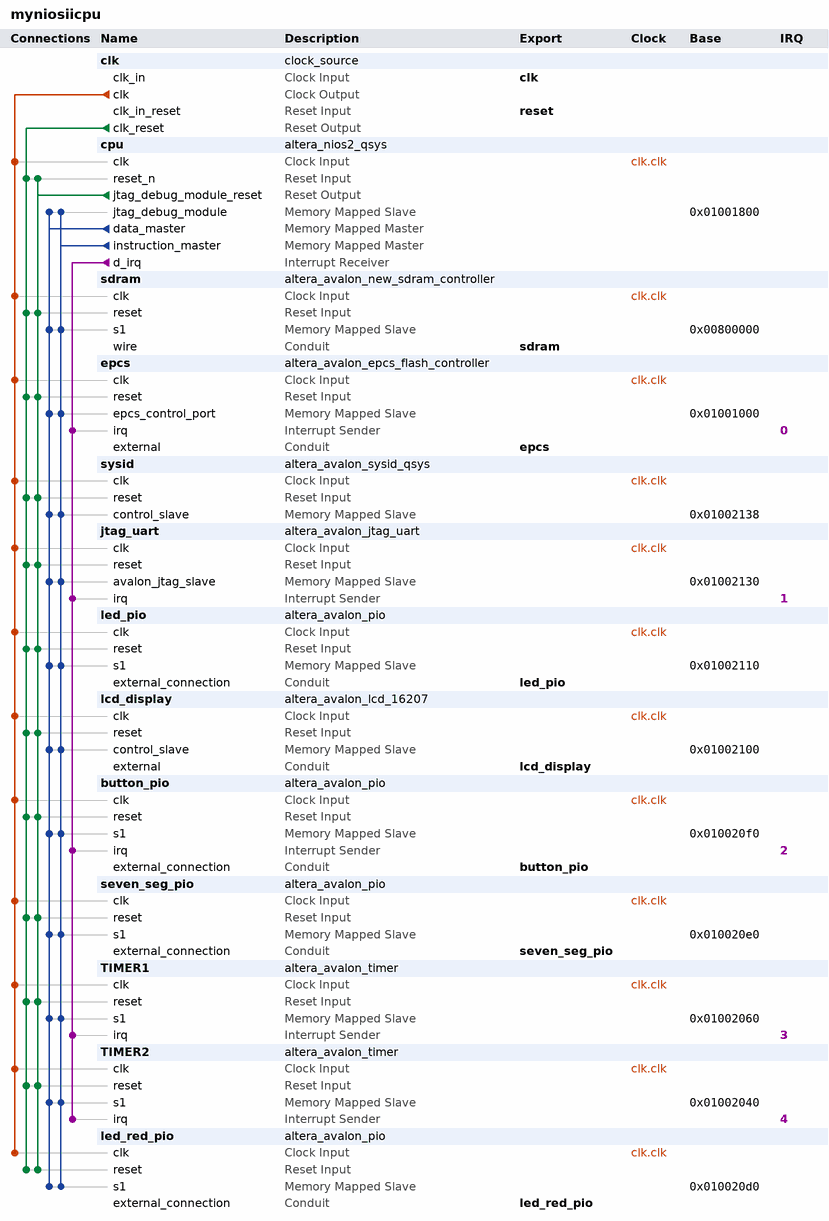
[diagram p0: system contents]
# Platform Designer (Qsys) system myniosiicpu, Cyclone IV E EP4CE115F29C7
# Parameters at their usual value, and those the tool derives, are not listed.
package require -exact qsys 13.0.1
create_system myniosiicpu
set_project_property DEVICE_FAMILY {Cyclone IV E}
set_project_property DEVICE EP4CE115F29C7

add_instance clk clock_source 13.0
set_instance_parameter_value clk clockFrequency 50000000

add_instance cpu altera_nios2_qsys 13.0
set_instance_parameter_value cpu resetSlave epcs.epcs_control_port
set_instance_parameter_value cpu mmu_TLBMissExcSlave None
set_instance_parameter_value cpu exceptionSlave sdram.s1
set_instance_parameter_value cpu breakSlave cpu.jtag_debug_module
set_instance_parameter_value cpu impl Fast
set_instance_parameter_value cpu icache_size 8192
set_instance_parameter_value cpu dcache_size 0

add_instance sdram altera_avalon_new_sdram_controller 13.0.1
set_instance_parameter_value sdram TAC 5.5
set_instance_parameter_value sdram TRCD 20.0
set_instance_parameter_value sdram TRP 20.0
set_instance_parameter_value sdram casLatency 3
set_instance_parameter_value sdram columnWidth 8
set_instance_parameter_value sdram dataWidth 16
set_instance_parameter_value sdram generateSimulationModel false
set_instance_parameter_value sdram model single_Micron_MT48LC4M32B2_7_chip
set_instance_parameter_value sdram numberOfBanks 4
set_instance_parameter_value sdram numberOfChipSelects 1
set_instance_parameter_value sdram powerUpDelay 100.0
set_instance_parameter_value sdram refreshPeriod 15.625
set_instance_parameter_value sdram rowWidth 12

add_instance epcs altera_avalon_epcs_flash_controller 13.0.1

add_instance sysid altera_avalon_sysid_qsys 13.0
set_instance_parameter_value sysid id 0

add_instance jtag_uart altera_avalon_jtag_uart 13.0.1
set_instance_parameter_value jtag_uart simInteractiveOptions NO_INTERACTIVE_WINDOWS

add_instance led_pio altera_avalon_pio 13.0.1
set_instance_parameter_value led_pio direction Output
set_instance_parameter_value led_pio width 8

add_instance lcd_display altera_avalon_lcd_16207 13.0.1

add_instance button_pio altera_avalon_pio 13.0.1
set_instance_parameter_value button_pio captureEdge true
set_instance_parameter_value button_pio direction Input
set_instance_parameter_value button_pio generateIRQ true
set_instance_parameter_value button_pio irqType EDGE
set_instance_parameter_value button_pio width 4

add_instance seven_seg_pio altera_avalon_pio 13.0.1
set_instance_parameter_value seven_seg_pio direction Output
set_instance_parameter_value seven_seg_pio width 8

add_instance TIMER1 altera_avalon_timer 13.0.1
set_instance_parameter_value TIMER1 period 500
set_instance_parameter_value TIMER1 periodUnits MSEC

add_instance TIMER2 altera_avalon_timer 13.0.1
set_instance_parameter_value TIMER2 period 1
set_instance_parameter_value TIMER2 periodUnits MSEC

add_instance led_red_pio altera_avalon_pio 13.0.1
set_instance_parameter_value led_red_pio direction Output
set_instance_parameter_value led_red_pio width 4

# connections
add_connection clk.clk button_pio.clk clock
add_connection clk.clk cpu.clk clock
add_connection clk.clk epcs.clk clock
add_connection clk.clk jtag_uart.clk clock
add_connection clk.clk lcd_display.clk clock
add_connection clk.clk led_pio.clk clock
add_connection clk.clk led_red_pio.clk clock
add_connection clk.clk sdram.clk clock
add_connection clk.clk seven_seg_pio.clk clock
add_connection clk.clk sysid.clk clock
add_connection clk.clk TIMER1.clk clock
add_connection clk.clk TIMER2.clk clock
add_connection clk.clk_reset button_pio.reset reset
add_connection clk.clk_reset cpu.reset_n reset
add_connection clk.clk_reset epcs.reset reset
add_connection clk.clk_reset jtag_uart.reset reset
add_connection clk.clk_reset lcd_display.reset reset
add_connection clk.clk_reset led_pio.reset reset
add_connection clk.clk_reset led_red_pio.reset reset
add_connection clk.clk_reset sdram.reset reset
add_connection clk.clk_reset seven_seg_pio.reset reset
add_connection clk.clk_reset sysid.reset reset
add_connection clk.clk_reset TIMER1.reset reset
add_connection clk.clk_reset TIMER2.reset reset
add_connection cpu.jtag_debug_module_reset button_pio.reset reset
add_connection cpu.jtag_debug_module_reset cpu.reset_n reset
add_connection cpu.jtag_debug_module_reset epcs.reset reset
add_connection cpu.jtag_debug_module_reset jtag_uart.reset reset
add_connection cpu.jtag_debug_module_reset lcd_display.reset reset
add_connection cpu.jtag_debug_module_reset led_pio.reset reset
add_connection cpu.jtag_debug_module_reset led_red_pio.reset reset
add_connection cpu.jtag_debug_module_reset sdram.reset reset
add_connection cpu.jtag_debug_module_reset seven_seg_pio.reset reset
add_connection cpu.jtag_debug_module_reset sysid.reset reset
add_connection cpu.jtag_debug_module_reset TIMER1.reset reset
add_connection cpu.jtag_debug_module_reset TIMER2.reset reset
add_connection cpu.data_master button_pio.s1 avalon
set_connection_parameter_value cpu.data_master/button_pio.s1 baseAddress 0x010020f0
add_connection cpu.data_master cpu.jtag_debug_module avalon
set_connection_parameter_value cpu.data_master/cpu.jtag_debug_module baseAddress 0x01001800
add_connection cpu.data_master epcs.epcs_control_port avalon
set_connection_parameter_value cpu.data_master/epcs.epcs_control_port baseAddress 0x01001000
add_connection cpu.data_master jtag_uart.avalon_jtag_slave avalon
set_connection_parameter_value cpu.data_master/jtag_uart.avalon_jtag_slave baseAddress 0x01002130
add_connection cpu.data_master lcd_display.control_slave avalon
set_connection_parameter_value cpu.data_master/lcd_display.control_slave baseAddress 0x01002100
add_connection cpu.data_master led_pio.s1 avalon
set_connection_parameter_value cpu.data_master/led_pio.s1 baseAddress 0x01002110
add_connection cpu.data_master led_red_pio.s1 avalon
set_connection_parameter_value cpu.data_master/led_red_pio.s1 baseAddress 0x010020d0
add_connection cpu.data_master sdram.s1 avalon
set_connection_parameter_value cpu.data_master/sdram.s1 baseAddress 0x00800000
add_connection cpu.data_master seven_seg_pio.s1 avalon
set_connection_parameter_value cpu.data_master/seven_seg_pio.s1 baseAddress 0x010020e0
add_connection cpu.data_master sysid.control_slave avalon
set_connection_parameter_value cpu.data_master/sysid.control_slave baseAddress 0x01002138
add_connection cpu.data_master TIMER1.s1 avalon
set_connection_parameter_value cpu.data_master/TIMER1.s1 baseAddress 0x01002060
add_connection cpu.data_master TIMER2.s1 avalon
set_connection_parameter_value cpu.data_master/TIMER2.s1 baseAddress 0x01002040
add_connection cpu.instruction_master button_pio.s1 avalon
set_connection_parameter_value cpu.instruction_master/button_pio.s1 baseAddress 0x010020f0
add_connection cpu.instruction_master cpu.jtag_debug_module avalon
set_connection_parameter_value cpu.instruction_master/cpu.jtag_debug_module baseAddress 0x01001800
add_connection cpu.instruction_master epcs.epcs_control_port avalon
set_connection_parameter_value cpu.instruction_master/epcs.epcs_control_port baseAddress 0x01001000
add_connection cpu.instruction_master jtag_uart.avalon_jtag_slave avalon
set_connection_parameter_value cpu.instruction_master/jtag_uart.avalon_jtag_slave baseAddress 0x01002130
add_connection cpu.instruction_master lcd_display.control_slave avalon
set_connection_parameter_value cpu.instruction_master/lcd_display.control_slave baseAddress 0x01002100
add_connection cpu.instruction_master led_pio.s1 avalon
set_connection_parameter_value cpu.instruction_master/led_pio.s1 baseAddress 0x01002110
add_connection cpu.instruction_master led_red_pio.s1 avalon
set_connection_parameter_value cpu.instruction_master/led_red_pio.s1 baseAddress 0x010020d0
add_connection cpu.instruction_master sdram.s1 avalon
set_connection_parameter_value cpu.instruction_master/sdram.s1 baseAddress 0x00800000
add_connection cpu.instruction_master seven_seg_pio.s1 avalon
set_connection_parameter_value cpu.instruction_master/seven_seg_pio.s1 baseAddress 0x010020e0
add_connection cpu.instruction_master sysid.control_slave avalon
set_connection_parameter_value cpu.instruction_master/sysid.control_slave baseAddress 0x01002138
add_connection cpu.instruction_master TIMER1.s1 avalon
set_connection_parameter_value cpu.instruction_master/TIMER1.s1 baseAddress 0x01002060
add_connection cpu.instruction_master TIMER2.s1 avalon
set_connection_parameter_value cpu.instruction_master/TIMER2.s1 baseAddress 0x01002040
add_connection cpu.d_irq button_pio.irq interrupt
set_connection_parameter_value cpu.d_irq/button_pio.irq irqNumber 2
add_connection cpu.d_irq epcs.irq interrupt
set_connection_parameter_value cpu.d_irq/epcs.irq irqNumber 0
add_connection cpu.d_irq jtag_uart.irq interrupt
set_connection_parameter_value cpu.d_irq/jtag_uart.irq irqNumber 1
add_connection cpu.d_irq TIMER1.irq interrupt
set_connection_parameter_value cpu.d_irq/TIMER1.irq irqNumber 3
add_connection cpu.d_irq TIMER2.irq interrupt
set_connection_parameter_value cpu.d_irq/TIMER2.irq irqNumber 4

# exported interfaces
add_interface clk clock sink
set_interface_property clk EXPORT_OF clk.clk_in
add_interface reset reset sink
set_interface_property reset EXPORT_OF clk.clk_in_reset
add_interface sdram conduit end
set_interface_property sdram EXPORT_OF sdram.wire
add_interface epcs conduit end
set_interface_property epcs EXPORT_OF epcs.external
add_interface led_pio conduit end
set_interface_property led_pio EXPORT_OF led_pio.external_connection
add_interface lcd_display conduit end
set_interface_property lcd_display EXPORT_OF lcd_display.external
add_interface button_pio conduit end
set_interface_property button_pio EXPORT_OF button_pio.external_connection
add_interface seven_seg_pio conduit end
set_interface_property seven_seg_pio EXPORT_OF seven_seg_pio.external_connection
add_interface led_red_pio conduit end
set_interface_property led_red_pio EXPORT_OF led_red_pio.external_connection

set_interconnect_requirement {$system} qsys_mm.clockCrossingAdapter HANDSHAKE
set_interconnect_requirement {$system} qsys_mm.maxAdditionalLatency 1

save_system myniosiicpu.qsys
